# Altium project buttonboard.PrjPcb
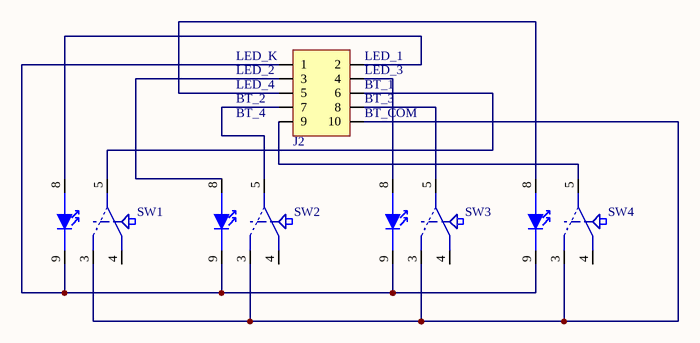
[diagram p0: buttonboard.SchDoc]
1 sheet, 5 parts. Net scope: global (net labels, ports and power ports of the same name join across sheets).
Board file: buttonboard.PcbDoc

## Sheet buttonboard.SchDoc
size A4

### Parts
J2  Wannenstecker 10pol 2,54mm  [WSL10G]  (value not drawn)
SW1  ITT_SER  [ITT_SER]  (value not drawn)
SW2  ITT_SER  [ITT_SER]  (value not drawn)
SW3  ITT_SER  [ITT_SER]  (value not drawn)
SW4  ITT_SER  [ITT_SER]  (value not drawn)

### Nets
NetJ2_1: J2.1 SW1.9 SW2.9 SW3.9 SW4.9
NetJ2_2: J2.2 SW1.8
NetJ2_3: J2.3 SW2.8
NetJ2_4: J2.4 SW3.8
NetJ2_5: J2.5 SW4.8
NetJ2_6: J2.6 SW1.5
NetJ2_7: J2.7 SW2.5
NetJ2_8: J2.8 SW3.5
NetJ2_9: J2.9 SW4.5
NetJ2_10: J2.10 SW1.3 SW2.3 SW3.3 SW4.3

Not connected (* = marked no-connect by the designer): SW1 4(2); SW2 4(2); SW3 4(2); SW4 4(2)

### Notes on the sheet
- (near J2) LED_K
- (near J2) LED_2
- (near J2) LED_4
- (near J2) LED_1
- (near J2) LED_3
- (near J2) BT_1
- (near J2) BT_2
- (near J2) BT_4
- (near J2) BT_3
- (near J2) BT_COM

### Library data of the parts
J2 = Wannenstecker 10pol 2,54mm: Reichelt code: WSL 10G
SW1-SW4 = ITT_SER: Digitaster LED; reichelt code: DIT 1 GE